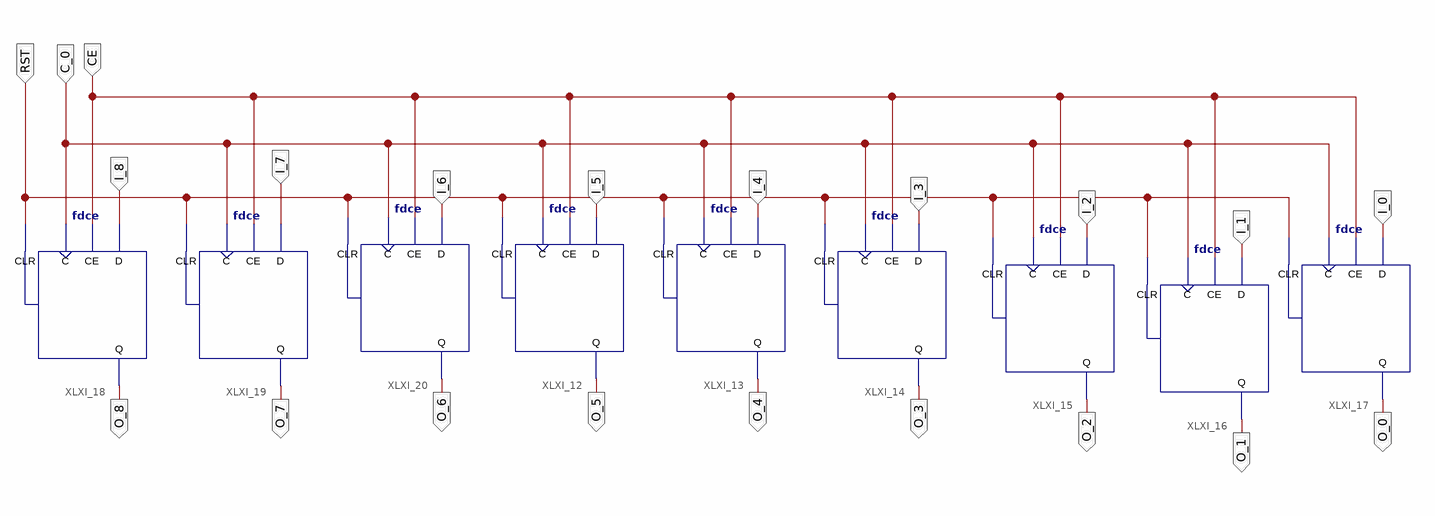
[diagram p0: schematic sheet 1]
// Xilinx ISE schematic Flip_flip9.sch (spartan3e) as structural Verilog: 9 symbols, 21 ports
module Flip_flip9 (
  input  C_0,
  input  RST,
  input  I_8,
  input  I_7,
  input  I_6,
  input  I_5,
  input  I_4,
  input  I_3,
  input  I_2,
  input  I_0,
  input  I_1,
  input  CE,
  output O_8,
  output O_7,
  output O_6,
  output O_5,
  output O_4,
  output O_3,
  output O_2,
  output O_1,
  output O_0
);

  fdce XLXI_12 (.C(C_0), .CE(CE), .CLR(RST), .D(I_5), .Q(O_5));
  fdce XLXI_13 (.C(C_0), .CE(CE), .CLR(RST), .D(I_4), .Q(O_4));
  fdce XLXI_14 (.C(C_0), .CE(CE), .CLR(RST), .D(I_3), .Q(O_3));
  fdce XLXI_15 (.C(C_0), .CE(CE), .CLR(RST), .D(I_2), .Q(O_2));
  fdce XLXI_16 (.C(C_0), .CE(CE), .CLR(RST), .D(I_1), .Q(O_1));
  fdce XLXI_17 (.C(C_0), .CE(CE), .CLR(RST), .D(I_0), .Q(O_0));
  fdce XLXI_18 (.C(C_0), .CE(CE), .CLR(RST), .D(I_8), .Q(O_8));
  fdce XLXI_19 (.C(C_0), .CE(CE), .CLR(RST), .D(I_7), .Q(O_7));
  fdce XLXI_20 (.C(C_0), .CE(CE), .CLR(RST), .D(I_6), .Q(O_6));
endmodule
